# EasyEDA schematic SCH_Shape-Of-Sound_2025-08-21.json
TITLE: Sheet_1; REV: 1.0; Date: 2025-06-22; Sheet: 1/1; Drawn By: zheng boon; Company: Your Company
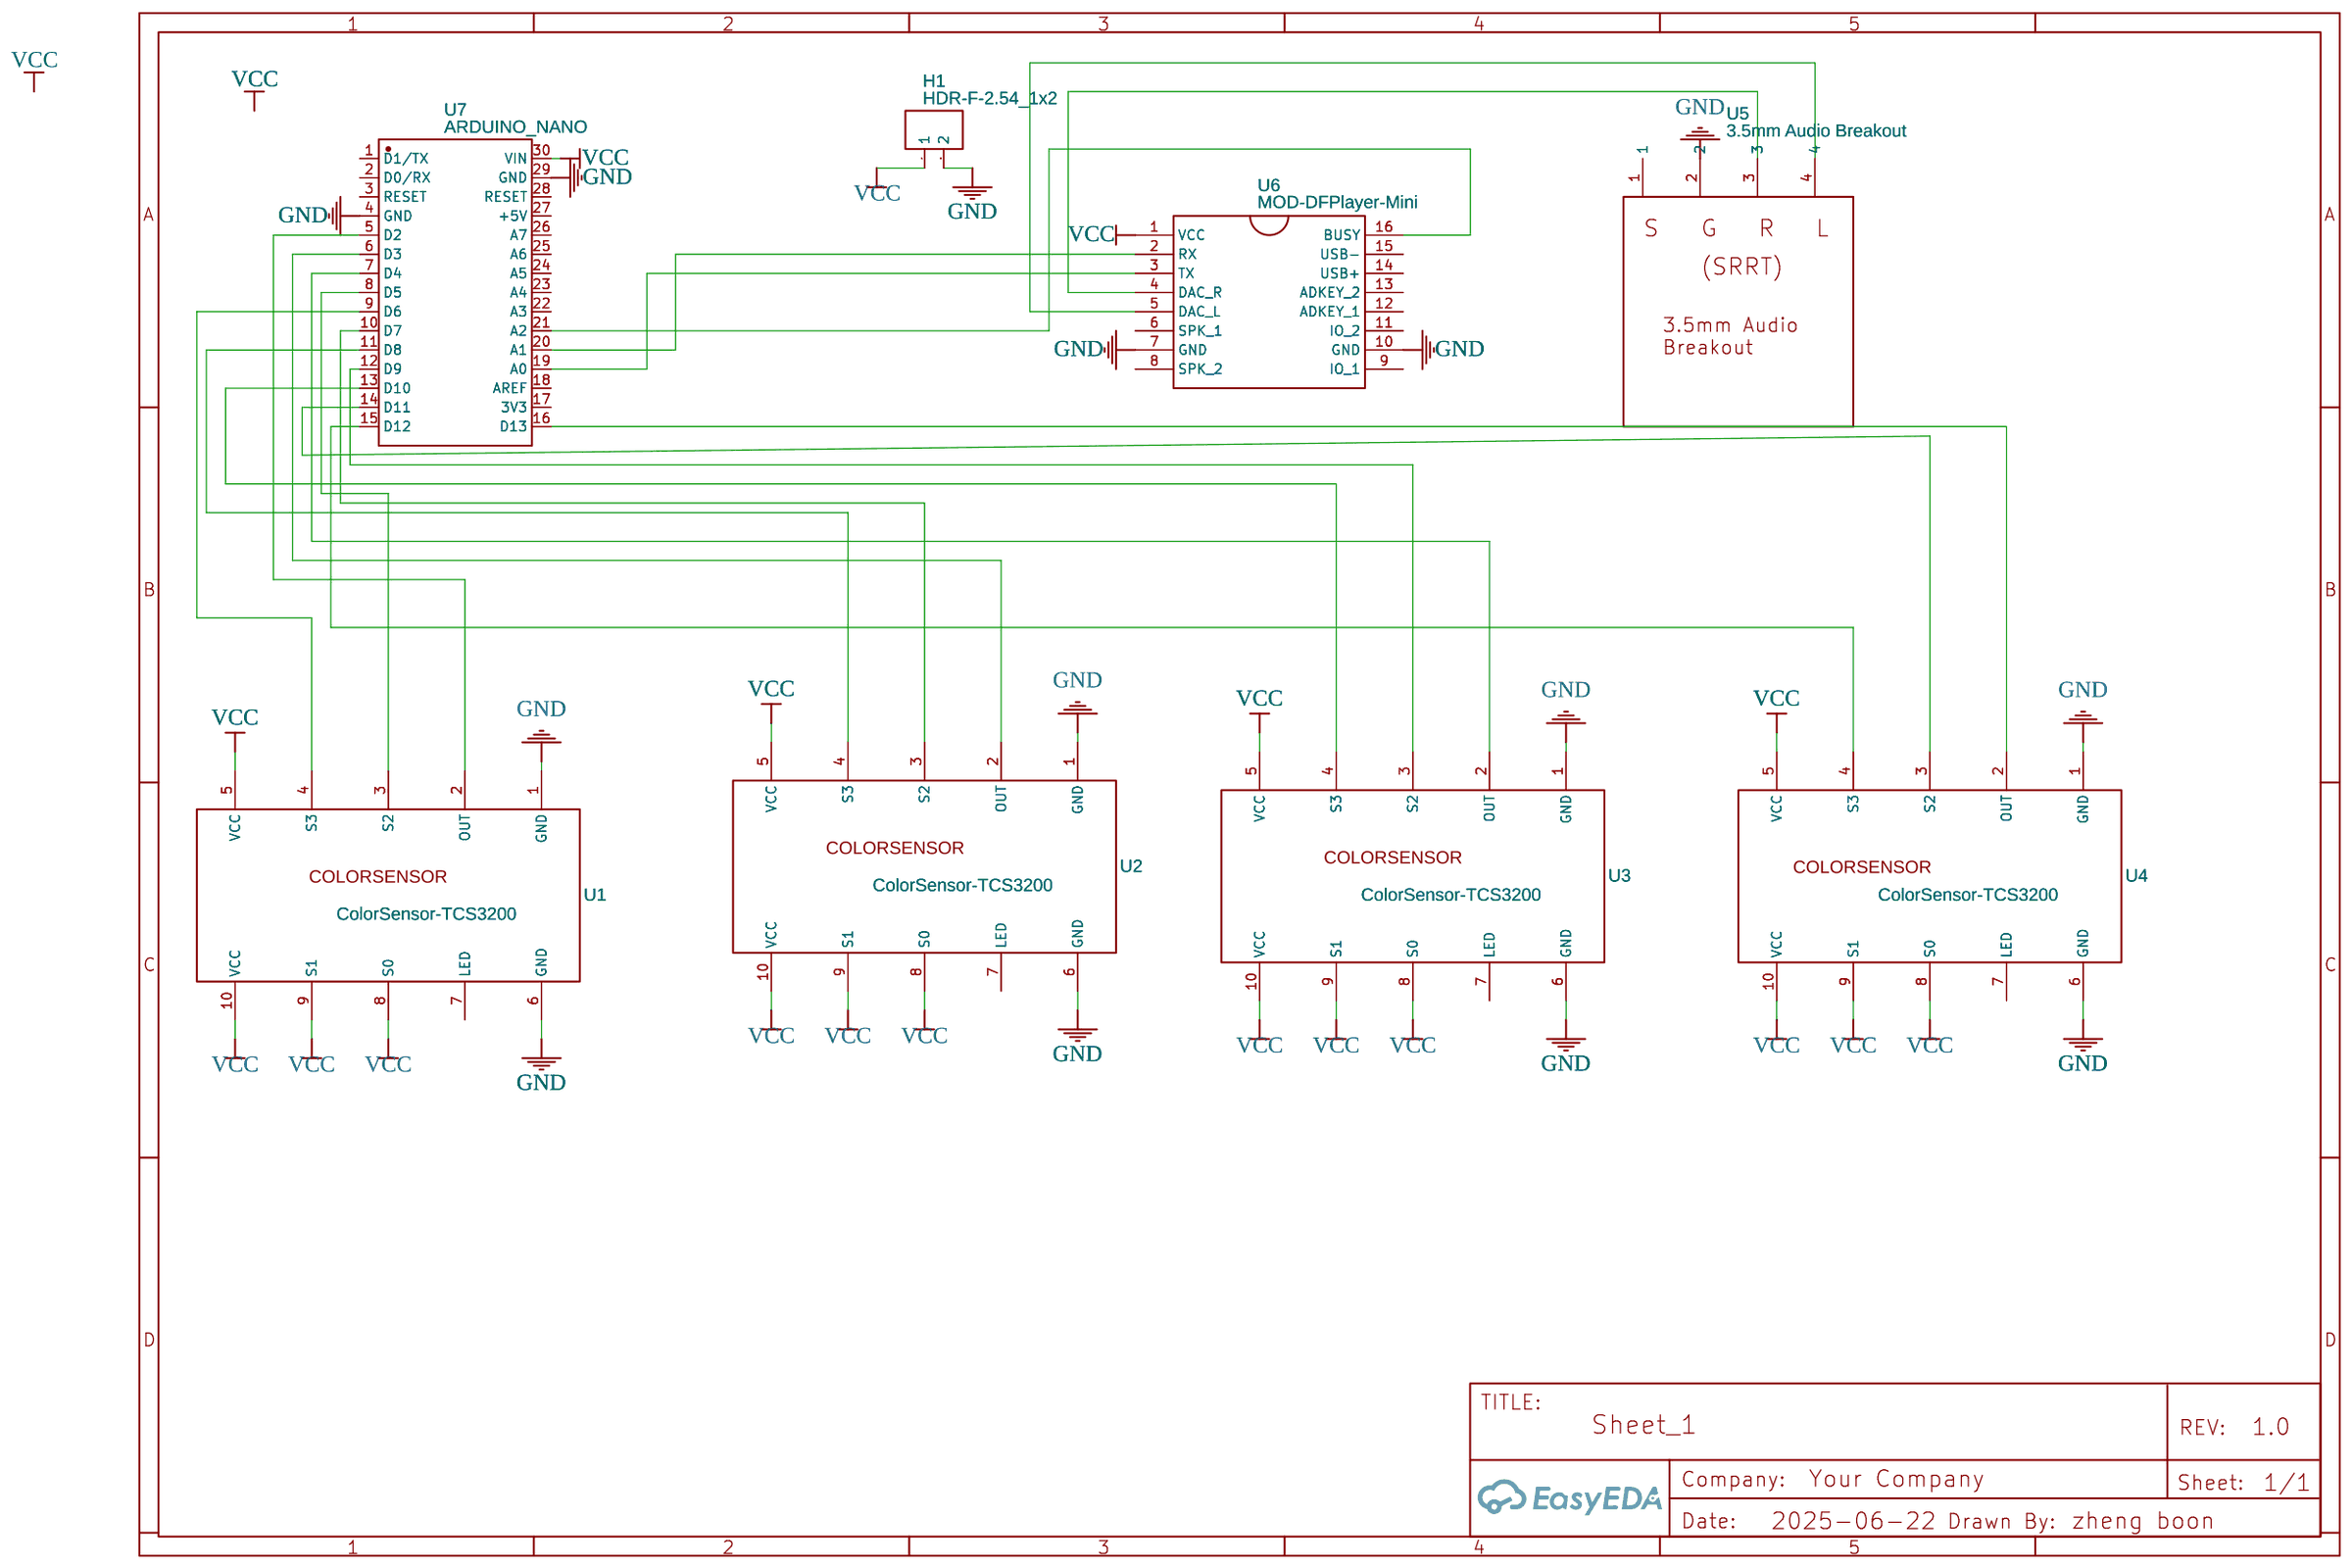
[diagram p0: schematic sheet]

## Parts
H1  HDR-F-2.54_1x2  [HDR-F-2.54_1X2]
U1  ColorSensor-TCS3200  [COLORSENSOR]
U2  ColorSensor-TCS3200  [COLORSENSOR]
U3  ColorSensor-TCS3200  [COLORSENSOR]
U4  ColorSensor-TCS3200  [COLORSENSOR]
U5  3.5mm Audio Breakout  [3.5MM AUDIO BREAKOUT]
U6  MOD-DFPlayer-Mini  [DFPLAYER-MINI-MODULE]
U7  ARDUINO_NANO  [COMM-TH_ARDUINO_NANO]

## Library data of the parts
H1 = HDR-F-2.54_1x2: Supplier Part: C49661; Supplier: LCSC; Contributor: LCEDA_Lib
U1-U4 = ColorSensor-TCS3200: Manufacturer Part: TCS230; Contributor: mahmoudd; Package Display: Yes
U5 = 3.5mm Audio Breakout: Contributor: james.gruber95
U6 = MOD-DFPlayer-Mini: Contributor: jackyw1368
U7 = ARDUINO_NANO: Contributor: lcsc; Supplier: LCSC; Supplier Part: C9900017879; Manufacturer: null; JLCPCB Part Class: Extended Part

## Nets
GND: H1.2 U1.1(GND) U1.6(GND) U2.1(GND) U2.6(GND) U3.1(GND) U3.6(GND) U4.1(GND) U4.6(GND) U5.2 U6.7(GND) U6.10(GND) U7.4(GND) U7.29(GND)
VCC: H1.1 U1.5(VCC) U1.8(S0) U1.9(S1) U1.10(VCC) U2.5(VCC) U2.8(S0) U2.9(S1) U2.10(VCC) U3.5(VCC) U3.8(S0) U3.9(S1) U3.10(VCC) U4.5(VCC) U4.8(S0) U4.9(S1) U4.10(VCC) U6.1(VCC) U7.30(VIN)
Net-(U1-2): U1.2(OUT) U7.5(D2)
Net-(U1-3): U1.3(S2) U7.8(D5)
Net-(U1-4): U1.4(S3) U7.9(D6)
Net-(U2-2): U2.2(OUT) U7.6(D3)
Net-(U2-3): U2.3(S2) U7.10(D7)
Net-(U2-4): U2.4(S3) U7.11(D8)
Net-(U3-2): U3.2(OUT) U7.7(D4)
Net-(U3-3): U3.3(S2) U7.12(D9)
Net-(U3-4): U3.4(S3) U7.13(D10)
Net-(U4-2): U4.2(OUT) U7.16(D13)
Net-(U4-3): U4.3(S2) U7.14(D11)
Net-(U4-4): U4.4(S3) U7.15(D12)
Net-(U5-3): U5.3 U6.4(DAC_R)
Net-(U5-4): U5.4 U6.5(DAC_L)
Net-(U6-2): U6.2(RX) U7.20(A1)
Net-(U6-3): U6.3(TX) U7.19(A0)
Net-(U6-16): U6.16(BUSY) U7.21(A2)

Not connected (* = marked no-connect by the designer): U1 7(LED); U2 7(LED); U3 7(LED); U4 7(LED); U5 1; U6 6(SPK_1) 8(SPK_2) 9(IO_1) 11(IO_2) 12(ADKEY_1) 13(ADKEY_2) 14(USB+) 15(USB-); U7 1(D1/TX) 2(D0/RX) 3(RESET) 17(3V3) 18(AREF) 22(A3) 23(A4) 24(A5) 25(A6) 26(A7) 27(+5V) 28(RESET)
